# EAGLE board RT5350F_OLinuXino_EVB_Rev_C (EAGLE 4.16), part 1 of 2
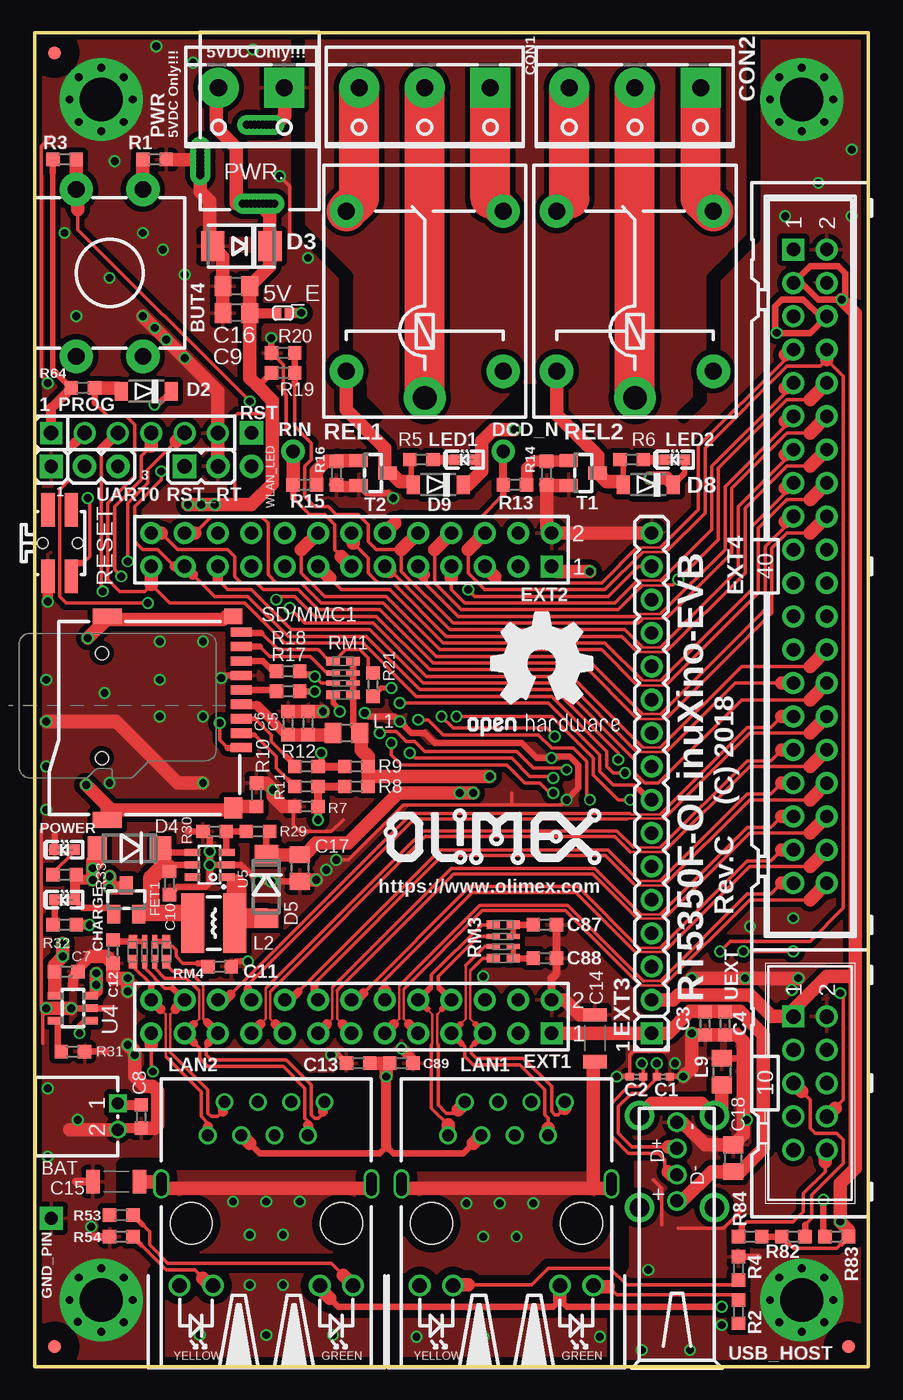
[diagram p1: board, top side]
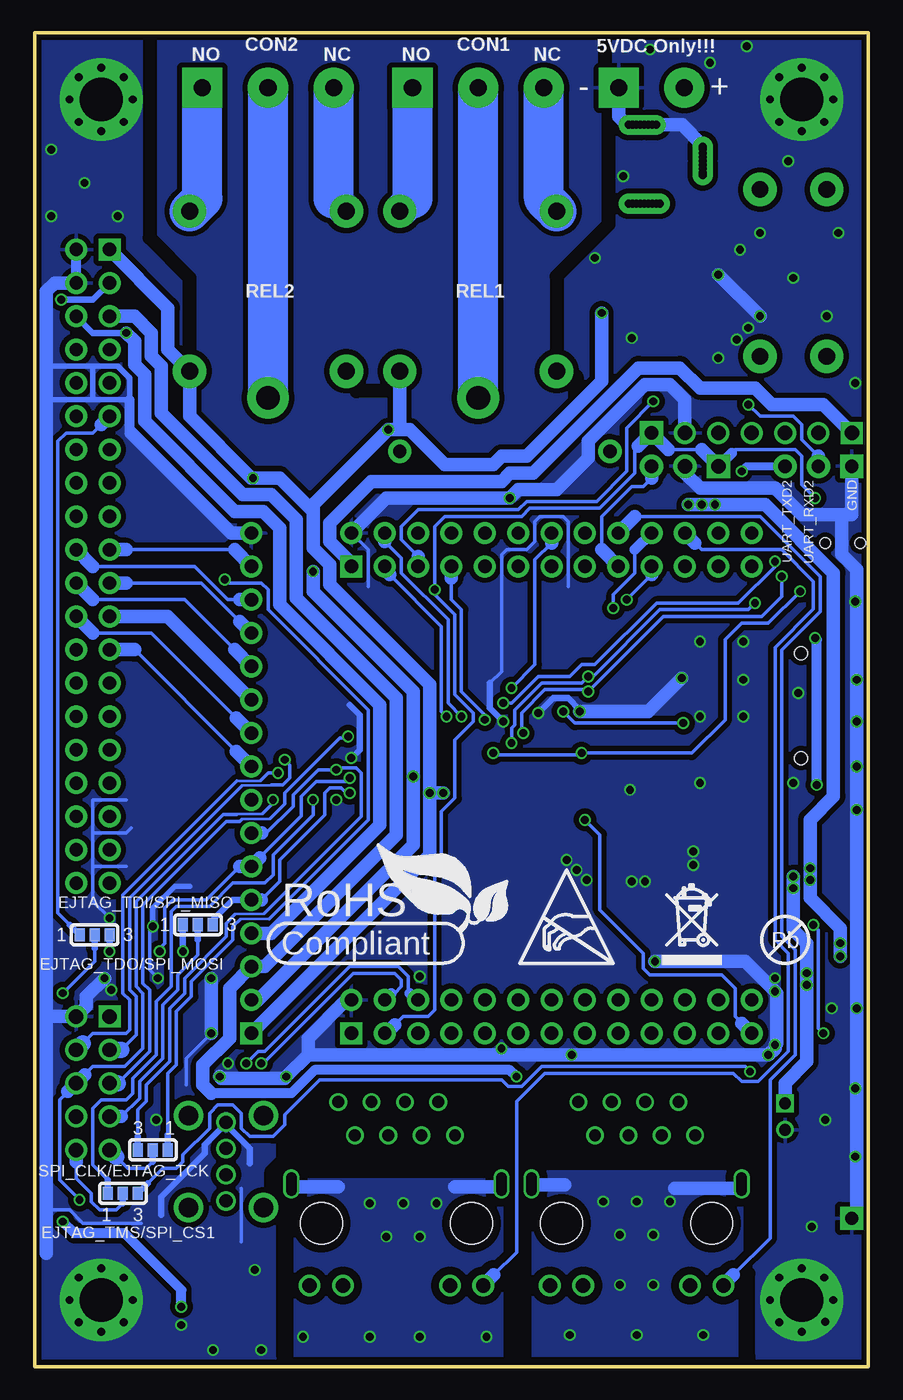
[diagram p2: board, bottom side, seen from below]

Size 63.5 x 101.6 mm. Coordinates in mm from the lower left corner, seen from the top.
Outline: 0,101.6 0,0 63.5,0 63.5,101.6 0,101.6
Copper layers (1+16): Top 0.035mm / dielectric 1.5mm / Bottom 0.035mm
Design rules "default": minimum track width 4mil, minimum drill 0.3mm, track to track 5mil, track to pad 5mil, pad to pad 5mil, via to via 5mil, smd to smd 1mil, copper to edge 10mil, drill to drill 8mil, minimum pad ring 6mil, minimum via ring 4mil, stop-mask expansion 4mil, vias tented up to drill 24mil, thermal gap 15mil
Net classes: 4 REL: width 2.032 mm, drill 2.54 mm
tRestrict: 42 lines
bRestrict: 14 lines

## Footprints (pad centres in the part's own frame; a part is rotated, then mirrored left to right if it is on the bottom)
SJ_1_SMALLER = smd 0.508 x 0.762: 1 -0.381,0; 2 0.381,0
DW02R = drill 0.9 square: 1 -1,0 | drill 0.9 round: 2 1,0
SW_TAKT12X12SS = drill 1.27 pad 2.54 round: P$1 -2.54,-6.35; P$2 2.54,-6.35; P$3 2.54,6.35; P$4 -2.54,6.35
C0402_TI = smd 0.61 x 0.584: 1 -0.508,0; 2 0.508,0
C0603_DWS = smd 1.016 x 1.016: 1 -0.889,0; 2 0.889,0
C0805_5MIL_DWS = smd 1.27 x 1.524: 1 -1.016,0; 2 1.016,0
C1206_5MILS_WS_ISO = smd 1.016 x 1.778: 1 -1.778,0; 2 1.778,0
LED-0603 = smd 0.8 x 0.8: A 0.762,0; C -0.762,0
DG306-5.0_3P = drill 1.3 pad 3.048 square: 1 -5,0 | drill 1.3 pad 3.048 round: 2 0,0; 3 5,0
SOD-123 = smd 1 x 1.4: A 1.9,0; C -1.9,0
DO214AA = smd 1.778 x 2.286: A 2.177,0; C -2.177,0
MLL-41 = smd 1.45 x 1.8: A 2.445,0; K -2.445,0
TESTPAD = drill 1.016 pad 1.778 round: P$1 0,0
SJ_2_SMALL = smd 0.762 x 1.016: 1 -1.143,0; 2 0,0; 3 1.143,0
PN2X13 = drill 1.016 pad 1.676 square: 1 -15.24,1.27 | drill 1.016 pad 1.676 round: 2 -15.24,-1.27; 3 -12.7,1.27; 4 -12.7,-1.27; 5 -10.16,1.27; 6 -10.16,-1.27; 7 -7.62,1.27; 8 -7.62,-1.27; 9 -5.08,1.27; 10 -5.08,-1.27; 11 -2.54,1.27; 12 -2.54,-1.27; 13 0,1.27; 14 0,-1.27; 15 2.54,1.27; 16 2.54,-1.27; 17 5.08,1.27; 18 5.08,-1.27; 19 7.62,1.27; 20 7.62,-1.27; 21 10.16,1.27; 22 10.16,-1.27; 23 12.7,1.27; 24 12.7,-1.27; 25 15.24,1.27; 26 15.24,-1.27
HN1X16 = drill 1.016 pad 1.676 square: 1 -17.78,0 | drill 1.016 pad 1.676 round: 2 -15.24,0; 3 -12.7,0; 4 -10.16,0; 5 -7.62,0; 6 -5.08,0; 7 -2.54,0; 8 0,0; 9 2.54,0; 10 5.08,0; 11 7.62,0; 12 10.16,0; 13 12.7,0; 14 15.24,0; 15 17.78,0; 16 20.32,0
ML40 = drill 1.016 pad 1.676 square: 1 -24.13,-1.27 | drill 1.016 pad 1.676 round: 2 -24.13,1.27; 3 -21.59,-1.27; 4 -21.59,1.27; 5 -19.05,-1.27; 6 -19.05,1.27; 7 -16.51,-1.27; 8 -16.51,1.27; 9 -13.97,-1.27; 10 -13.97,1.27; 11 -11.43,-1.27; 12 -11.43,1.27; 13 -8.89,-1.27; 14 -8.89,1.27; 15 -6.35,-1.27; 16 -6.35,1.27; 17 -3.81,-1.27; 18 -3.81,1.27; 19 -1.27,-1.27; 20 -1.27,1.27; 21 1.27,-1.27; 22 1.27,1.27; 23 3.81,-1.27; 24 3.81,1.27; 25 6.35,-1.27; 26 6.35,1.27; 27 8.89,-1.27; 28 8.89,1.27; 29 11.43,-1.27; 30 11.43,1.27; 31 13.97,-1.27; 32 13.97,1.27; 33 16.51,-1.27; 34 16.51,1.27; 35 19.05,-1.27; 36 19.05,1.27; 37 21.59,-1.27; 38 21.59,1.27; 39 24.13,-1.27; 40 24.13,1.27
SOT23 = smd 1.4 x 1: 1 1.1,-0.95; 2 1.1,0.95; 3 -1.1,0
TEST_PAD40/70/SQUARE = drill 1.016 pad 1.778 square: P$1 0,0
L0805_5MIL_DWS = smd 1.27 x 1.524: 1 -1.016,0; 2 1.016,0
CD42(43) = smd 1.75 x 4.5: 1 -1.6,0; 2 1.6,0
RJLBC-060TC1_MILLING = drill 0.9 round: 1 -4.455,6.7; 2 -3.185,9.24; 3 -1.915,6.7; 4 -0.645,9.24; 5 0.625,6.7; 6 1.895,9.24; 7 3.165,6.7; 8 4.435,9.24 | drill 0.8 round: _1 -8,2.5; _2 -8,2.7; _3 -8,2.9; _4 -8,3.3; _5 -8,3.5; _6 8,3.5; _7 8,3.3; _8 8,2.9; _9 8,2.7; _10 8,2.5; GND1 -8,3.1; GND2 8,3.1 | drill 1.1 round: AG 4.07,-4.748; AY -6.61,-4.748; KG 6.61,-4.748; KY -4.07,-4.748 | hole 3.2: -5.715,0; 5.715,0
PN1X6 = drill 1.1 pad 1.676 square: 1 -6.35,0 | drill 1.1 pad 1.676 round: 2 -3.81,0; 3 -1.27,0; 4 1.27,0; 5 3.81,0; 6 6.35,0
PWR_JACK_UNI_MILLING = drill 0.6 pad 1.5 round: + -0.196,4.75; +1 -0.196,5.05; +2 -0.196,5.35; +3 -0.196,5.65; +4 -0.196,4.45; +5 -0.196,4.15; +6 -0.196,3.85; +7 -0.196,3.55; +8 -0.196,5.95; - -6.196,4.75; -1 -6.196,5.05; -2 -6.196,5.35; -3 -6.196,4.45; -4 -6.196,4.15; -5 -6.196,5.65; -6 -6.196,3.85; -8 -6.196,5.95; -- -3.446,0.3; --1 -3.746,0.3; --2 -4.046,0.3; --3 -4.346,0.3; --4 -3.146,0.3; --5 -2.846,0.3; --6 -2.546,0.3; --14 -4.546,0.3; --15 -2.346,0.3
DG306-5.0_2P = drill 1.3 pad 3.048 square: 1 -2.5,0 | drill 1.3 pad 3.048 round: 2 2.5,0
R0603_5MIL_DWS = smd 1.016 x 1.016: 1 -0.889,0; 2 0.889,0
H200-FAT = drill 1.295 pad 2.54 round: 1 -7.493,-5.969; 2 -7.493,5.969; O 4.699,5.969; S 4.699,-5.969 | drill 1.803 pad 3.175 round: P -9.525,0
SW_TAKT3X4 = smd 2.54 x 1.016: 1_1 2.54,-0.889; 1_2 -2.54,-0.889; 2_1 2.54,0.889; 2_2 -2.54,0.889 | hole 0.8: 0,1.397; 0,-1.27
R_MATRIX_4 = smd 0.635 x 1.016: 1.1 -1.27,-0.762; 1.2 -1.27,0.762; 4.1 1.27,-0.762; 4.2 1.27,0.762 | smd 0.381 x 1.016: 2.1 -0.381,-0.762; 2.2 -0.381,0.762; 3.1 0.381,-0.762; 3.2 0.381,0.762
JP1 = drill 1.1 pad 1.778 square: 1 0,-1.27 | drill 1.1 pad 1.778 round: 2 0,1.27
TFC-WPAPR-08 = smd 1.6 x 0.7: 1 -6.994,2.25; 2 -6.994,1.15; 3 -6.994,0.05; 4 -6.994,-1.05; 5 -6.994,-2.15; 6 -6.994,-3.25; 7 -6.994,-4.35; 8 -6.994,-5.45; 9 -6.994,-6.55 | smd 1.4 x 1.2: 10 -6.369,-7.75 | smd 1.4 x 1.6: 11 -6.369,6.85 | smd 2.2 x 1.2: 12 3.231,-7.75; 13 3.231,7.75 | hole 1: 3.631,-4.95; 3.631,3.05
FIDUCIAL-1X3 = smd 1 x 1: 1 0,0
SOT23-5 = smd 1.2 x 0.55: 1 1.3,-0.95; 2 1.3,0; 3 1.3,0.95; 4 -1.3,0.95; 5 -1.3,-0.95
SOT23-6 = smd 1.2 x 0.55: 1 1.3,-0.95; 2 1.3,0; 3 1.3,0.95; 4 -1.3,0.95; 5 -1.3,0; 6 -1.3,-0.95
HN1X3 = drill 1 pad 1.778 square: 1 -2.54,0 | drill 1 pad 1.778 round: 2 0,0; 3 2.54,0
ML10-MALE = drill 1.1 pad 1.676 square: 1 -5.08,-1.27 | drill 1.1 pad 1.676 round: 2 -5.08,1.27; 3 -2.54,-1.27; 4 -2.54,1.27; 5 0,-1.27; 6 0,1.27; 7 2.54,-1.27; 8 2.54,1.27; 9 5.08,-1.27; 10 5.08,1.27
USB_A_VERTICAL_PTH = drill 1 round: 1 3.45,12.75; 2 3.45,14.75; 3 3.45,16.75; 4 3.45,18.75 | drill 1.5 round: P$1 0.6,12.25; P$2 6.3,12.25; P$3 6.3,19.25; P$4 0.6,19.25

## Placement (x,y rotation side)
5V_E  Opened  [SJ_1_SMALLER]  18.92,80.26 0 top
BAT  DW02R  [DW02R]  6.35,19.05 270 top
BUT4  DTSM24R(12x12x10)  [SW_TAKT12X12SS]  5.71,83.31 180 top
C1  NA  [C0402_TI]  47.88,22.1 0 top
C2  NA  [C0402_TI]  45.85,22.1 180 top
C3  100nF  [C0603_DWS]  51.05,26.16 270 top
C4  22uF/6.3V  [C0603_DWS]  52.58,26.16 270 top
C5  22uF/6.3V  [C0603_DWS]  20.83,49.02 90 top
C6  NA(22uF/6.3V)  [C0603_DWS]  19.3,49.02 90 top
C7  22uF/6.3V  [C0603_DWS]  2.41,30.1 0 top
C8  22uF/6.3V  [C0603_DWS]  8.13,19.05 270 top
C9  47uF/6.3V/20%/X5R/C0805  [C0805_5MIL_DWS]  15.37,80.26 180 top
C10  22uF/6.3V  [C0603_DWS]  10.29,36.83 270 top
C11  100nF  [C0603_DWS]  14.1,30.48 180 top
C12  100nF  [C0603_DWS]  5.97,31.62 90 top
C13  100nF  [C0603_DWS]  24.64,23.11 0 top
C14  1nF/2kV/X7R/1206  [C1206_5MILS_WS_ISO]  42.67,25.02 90 top
C15  1nF/2kV/X7R/1206  [C1206_5MILS_WS_ISO]  6.22,14.1 180 top
C16  47uF/6.3V/20%/X5R/C0805  [C0805_5MIL_DWS]  15.37,82.3 180 top
C17  47uF/6.3V/20%/X5R/C0805  [C0805_5MIL_DWS]  20.19,37.97 270 top
C18  47uF/6.3V/20%/X5R/C0805  [C0805_5MIL_DWS]  53.21,15.88 90 top
C87  100nF  [C0603_DWS]  38.86,33.66 180 top
C88  100nF  [C0603_DWS]  38.86,31.11 180 top
C89  100nF  [C0603_DWS]  27.94,23.11 180 top
CHARGE  LED/YELLOW/0603  [LED-0603]  2.29,35.56 0 top
CON1  CON3-DG306-5.0_3P(TB3-5MM)  [DG306-5.0_3P]  29.72,97.41 180 top
CON2  CON3-DG306-5.0_3P(TB3-5MM)  [DG306-5.0_3P]  45.72,97.41 180 top
D2  1N5819(S4SOD-123)  [SOD-123]  8.51,74.3 180 top
D3  SMBJ6.0A  [DO214AA]  15.75,85.34 180 top
D4  1N5822/SS34/SMA  [MLL-41]  7.24,39.5 180 top
D5  1N5822/SS34/SMA  [MLL-41]  17.65,36.58 270 top
D8  1N5819(S4SOD-123)  [SOD-123]  46.74,67.18 180 top
D9  1N5819(S4SOD-123)  [SOD-123]  30.73,67.18 180 top
DCD_N  TESTPAD40/70  [TESTPAD]  35.69,69.72 0 top
EJTAG_TDI/SPI_MISO  EJTAG_TDI:closed/SPI_MISO:opened  [SJ_2_SMALL]  51.05,33.66 0 bottom
EJTAG_TDO/SPI_MOSI  EJTAG_TDO:closed/SPI_MOSI:opened  [SJ_2_SMALL]  58.93,32.89 0 bottom
EJTAG_TMS/SPI_CS1  EJTAG_TMS:closed/SPI_CS1:opened  [SJ_2_SMALL]  56.77,13.21 0 bottom
EXT1  ML26PN2X13  [PN2X13]  24.13,26.67 180 top
EXT2  ML26PN2X13  [PN2X13]  24.13,62.23 180 top
EXT3  PN1X16  [HN1X16]  46.99,43.18 90 top
EXT4  BH40S  [ML40]  59.05,60.96 270 top
FET1  WPM2015-3/TR  [SOT23]  6.99,35.56 270 top
GND_PIN  TESTPAD3  [TEST_PAD40/70/SQUARE]  1.27,11.3 0 top
L1  FB0805/600R/2A  [L0805_5MIL_DWS]  23.75,48.26 180 top
L2  4.7uH/1.15A/DCR<0.1R/CD43  [CD42(43)]  13.65,33.78 0 top
L9  FB0805/600R/2A  [L0805_5MIL_DWS]  52.32,22.48 270 top
LAN1  RJLBC-060TC1_GND_MILLING  [RJLBC-060TC1_MILLING]  35.94,10.92 0 top
LAN2  RJLBC-060TC1_GND_MILLING  [RJLBC-060TC1_MILLING]  17.65,10.92 0 top
LED1  LED/RED/0603  [LED-0603]  32.77,69.09 0 top
LED2  LED/RED/0603  [LED-0603]  48.77,69.09 0 top
POWER  LED/RED/0603  [LED-0603]  2.29,39.37 0 top
PROG  NA(PN1X6)  [PN1X6]  7.62,71.12 0 top
PWR  PWRJ-2mm(YDJ-1134)  [PWR_JACK_UNI_MILLING]  12.32,88.39 270 top
PWR.  NA(TB2/3.5mm)  [DG306-5.0_2P]  16.51,97.41 180 top
R1  560R  [R0603_5MIL_DWS]  9.14,91.95 180 top
R2  NA  [R0603_5MIL_DWS]  53.59,4.19 270 top
R3  10k  [R0603_5MIL_DWS]  2.29,91.95 180 top
R4  560R  [R0603_5MIL_DWS]  53.59,7.49 90 top
R5  2.2k  [R0603_5MIL_DWS]  29.46,69.09 0 top
R6  2.2k  [R0603_5MIL_DWS]  45.47,69.09 0 top
R7  NA(1M)  [R0603_5MIL_DWS]  20.7,42.67 0 top
R8  10k  [R0603_5MIL_DWS]  24.51,44.2 0 top
R9  10k  [R0603_5MIL_DWS]  24.51,45.72 0 top
R10  10k  [R0603_5MIL_DWS]  16.89,43.56 90 top
R11  100R  [R0603_5MIL_DWS]  20.7,44.2 0 top
R12  100R  [R0603_5MIL_DWS]  20.7,45.72 0 top
R13  1k  [R0603_5MIL_DWS]  36.58,67.18 180 top
R14  10k  [R0603_5MIL_DWS]  38.99,68.07 270 top
R15  1k  [R0603_5MIL_DWS]  20.57,67.18 180 top
R16  10k  [R0603_5MIL_DWS]  22.99,68.07 270 top
R17  100R  [R0603_5MIL_DWS]  19.3,51.44 0 top
R18  100R  [R0603_5MIL_DWS]  19.3,52.96 0 top
R19  1.1k/1%  [R0603_5MIL_DWS]  18.92,75.69 0 top
R20  2.2k  [R0603_5MIL_DWS]  18.92,77.22 180 top
R21  1k  [R0603_5MIL_DWS]  25.78,51.94 90 top
R29  8.25k/1%  [R0603_5MIL_DWS]  17.02,40.77 180 top
R30  1.1k/1%  [R0603_5MIL_DWS]  13.72,40.77 180 top
R31  2k/1%  [R0603_5MIL_DWS]  2.92,24 0 top
R32  2.2k  [R0603_5MIL_DWS]  2.29,33.66 0 top
R33  2.2k  [R0603_5MIL_DWS]  2.29,37.47 180 top
R53  NA  [R0603_5MIL_DWS]  6.6,11.56 180 top
R54  560R  [R0603_5MIL_DWS]  6.6,9.91 180 top
R64  10k  [R0603_5MIL_DWS]  3.68,74.55 180 top
R82  NA(2.2k)  [R0603_5MIL_DWS]  57.78,9.91 180 top
R83  NA(2.2k)  [R0603_5MIL_DWS]  61.09,9.91 0 top
R84  47k  [R0603_5MIL_DWS]  54.48,9.91 0 top
REL1  RAS-0515  [H200-FAT]  29.72,83.31 90 top
REL2  RAS-0515  [H200-FAT]  45.72,83.31 90 top
RESET  SIDE_WTCM-TR(3X4)  [SW_TAKT3X4]  1.91,62.74 270 top
RIN  TESTPAD40/70  [TESTPAD]  19.68,69.72 0 top
RM1  RA1206_(4X0603)_4B8_100K  [R_MATRIX_4]  23.5,52.45 90 top
RM3  NA(RA1206_(4X0603)_4B8_51R)  [R_MATRIX_4]  35.69,32.38 270 top
RM4  NA(RA1206_(4X0603)_4B8_51R)  [R_MATRIX_4]  8.76,31.62 0 top
RST  TESTPAD3  [TEST_PAD40/70/SQUARE]  16.51,71.12 0 top
RST_RT  NA(HN1x2)  [JP1]  12.7,68.58 270 top
SD/MMC1  TFC-WPAPR-08  [TFC-WPAPR-08]  8.76,49.4 180 top
SPI_CLK/EJTAG_TCK  SPI_CLK:opened/EJTAG_TCK:closed  [SJ_2_SMALL]  54.48,16.51 180 bottom
T1  BC817-40(SMD)  [SOT23]  41.78,68.07 180 top
T2  BC817-40(SMD)  [SOT23]  25.78,68.07 180 top
U1  FIDUCIAL  [FIDUCIAL-1X3]  1.52,100.08 0 top
U2  FIDUCIAL  [FIDUCIAL-1X3]  61.98,1.52 0 top
U3  FIDUCIAL  [FIDUCIAL-1X3]  1.52,1.52 0 top
U4  BL4054B-42TPRN  [SOT23-5]  2.92,27.3 0 top
U5  MT3608(SOT23-6)  [SOT23-6]  13.34,38.23 0 top
U$1  [LOGO-OPENHARDWARE_8X8]  38.61,53.47 0 top
U$3  [PB_SMALL]  6.35,32.51 0 bottom
U$8  [RECYCLE_BIN1/8]  15.75,30.61 0 bottom
U$9  [ROHS]  44.7,31.37 0 bottom
U$10  [OLIMEX1_V]  44.32,38.1 0 top
U$11  [ESD_SYMBOL]  26.54,30.73 0 bottom
UART0  HN1X3  [HN1X3]  3.81,68.58 0 top
UEXT  BH10S  [ML10-MALE]  59.05,21.59 270 top
USB_HOST  USB_A_VERTICAL  [USB_A_VERTICAL_PTH]  45.47,-0.13 0 top
WLAN_LED  TESTPAD40/70  [TESTPAD]  16.51,68.58 0 top

## Tracks (layer width: path | path; a pad name or v marks a point on that pad's centre or on a via)
5VDC_IN  (via drill 0.6)
  Top 0.254: 18.1,72.61 15.46,72.61 15.24,72.39 15.24,65.66
  Top 0.406: 17.02,74.68 R19.1
  Top 0.508: 18.29,80.26 5V_E.1 | U4.4 1.52,28.25 1.52,28.57 | CHARGE.A 3.68,34.92 5.57,34.92 FET1.1
  Top 0.762: C9.1 18.29,80.26 | v4.45,37.08 3.05,37.08 | 3.05,37.08 CHARGE.A | R33.1 3.05,37.47 3.05,37.08
  Top 1.016: PWR.+ 18.29,88.59 | PWR..2 13.84,97.24 13.84,94.36 15.37,92.84 15.37,88.59 PWR.+ | PWR.+ 17.91,87.75 17.91,85.36 | 17.91,85.36 D3.C | 17.91,85.36 17.91,83.82 C16.1 C9.1 16.38,75.31 17.02,74.68 18.1,73.6 18.1,72.61 18.1,67.25 16.51,65.66 15.24,65.66 v13.72,65.66 v12.7,65.66 v11.68,65.66 | 1.52,28.57 C7.1 1.52,30.61 v2.16,31.24 v2.16,32.26 | v4.45,37.08 v4.45,37.97 | v4.45,37.97 4.45,38.48 4.57,38.61 4.57,39.27 D4.A 4.79,38.32 v4.45,37.97
  Bottom 1.016: v2.16,31.24 v2.16,32.26 2.16,33.4 4.45,35.69 v4.45,37.08 v4.45,37.97 4.45,41.66 2.67,43.43 2.67,60.45 7.87,65.66 v11.68,65.66 v12.7,65.66 v13.72,65.66
+5V  (via drill 0.6)
  Top 0.406: D8.C 49.53,68.08 LED2.A | 34.04,69.09 LED1.A
  Top 0.508: 19.56,80.26 5V_E.2 | D5.K 17.65,40.51 R29.1
  Top 0.762: v20.32,80.26 19.56,80.26
  Top 1.016: EXT1.1 EXT3.1 48.26,25.4 49.91,27.05 C3.1 C4.1 53.72,27.05 55.5,25.27 55.5,16.64 53.72,14.86 C18.1 51.56,14.86 49.33,12.62 USB_HOST.1 | v33.4,43.69 v32.38,43.69 27.69,43.69 23.88,39.88 21.46,39.88 20.57,38.99 C17.1 17.65,38.99 D5.K | D8.C 48.13,67.69 v46.86,67.69 | v36.58,71.37 34.92,71.37 34.04,70.48 34.04,69.09 34.04,68.2 33.02,67.18 D9.C
  Bottom 1.016: v33.4,43.69 33.4,38.99 EXT3.1 | v33.4,43.69 33.4,51.94 41.02,59.56 41.02,61.09 42.29,62.36 42.29,65.15 | EXT4.1 53.34,80.64 53.34,77.47 REL2.1 51.69,72.39 46.99,67.69 v46.86,67.69 44.83,67.69 42.29,65.15 | 42.29,65.15 42.29,65.66 v36.58,71.37 35.69,71.37 | 35.69,71.37 REL1.1 | 35.69,71.37 34.92,71.37 32.26,68.71 28.57,68.71 27.94,69.34 26.04,69.34 20.32,75.06 v20.32,80.26 | v32.38,43.69 v33.4,43.69
COMP
  Bottom 0.254: 47.88,56.77 50.8,59.69 56.52,59.69
  Bottom 1.016: EXT3.13 47.88,56.77 | 56.52,59.69 EXT4.21
CTS_N
  Top 0.178: 46.3,54.79 47.68,54.79
  Top 0.203: 46.28,54.81 46.3,54.79 | 47.68,54.79 47.7,54.81
  Top 0.254: 27.05,60.58 27.3,60.33 27.43,60.33 31.62,56.13 44.96,56.13 46.28,54.81 | 47.7,54.81 53.59,60.71 53.59,65.53 57.15,69.09 57.15,69.47
  Top 1.016: 27.05,60.58 EXT2.11 | 57.15,69.47 57.53,69.85 EXT4.13
DAT1
  Top 0.254: RM1.3.2 22.25,52.83 20.98,54.1 17.91,54.1 17.14,54.86
  Top 0.508: SD/MMC1.8 15.77,54.86 17.14,54.86
DAT2  (via drill 0.6)
  Top 0.254: 14.73,47.12 14.1,47.75 v14.1,49.02
  Top 0.406: RM1.1.2 22.73,50.55 23.24,50.04 v23.24,49.91
  Top 0.508: SD/MMC1.1 15.72,47.12 14.73,47.12
  Bottom 0.254: v23.24,49.91 22.35,49.02 v14.1,49.02
DCD_N
  Top 0.254: 27.43,64.26 27.94,64.77 34.04,64.77 35.69,66.42
  Top 0.508: 35.69,66.42 R13.2
  Top 0.61: R13.2 DCD_N.P$1
  Top 1.016: EXT2.12 27.43,64.26
DTR_N
  Top 0.178: 45.9,51.89 48.08,51.89
  Top 0.203: 45.87,51.92 45.9,51.89 | 48.08,51.89 48.11,51.92
  Top 0.254: 20.32,62.23 20.32,60.45 22.1,58.67 26.8,58.67 30.86,54.61 43.18,54.61 45.87,51.92 | 59.05,66.04 57.28,66.04 55.12,63.88 55.12,58.93 48.11,51.92
  Top 1.016: 20.32,62.23 EXT2.16 | 59.05,66.04 EXT4.16
EJTAG_TCK  (via drill 0.6)
  Top 0.178: 48.08,59.51 46.3,59.51
  Top 0.203: 46.3,59.51 46.28,59.49 | 48.11,59.54 48.08,59.51
  Top 0.254: 30.48,62.23 30.48,59.69 32.51,57.66 44.45,57.66 46.28,59.49 | 59.05,73.66 57.28,73.66 52.07,68.45 52.07,62.99 v49.02,59.94 48.62,59.54 48.11,59.54
  Top 1.016: 30.48,62.23 EXT2.8 | 59.05,73.66 EXT4.10
  Bottom 0.178: 47.84,34.07 47.8,34.11 45.64,34.11
  Bottom 0.254: v49.02,59.94 48.77,59.69 46.23,59.69 45.72,59.18 45.72,57.66 38.1,50.04 38.1,41.66 45.64,34.11 | 47.84,34.07 48.39,33.53 48.39,32.51 51.56,29.34 51.56,28.19 52.7,27.05 52.7,22.99 53.34,22.35 53.34,17.65
  Bottom 0.508: SPI_CLK/EJTAG_TCK.1 53.34,17.65
EJTAG_TCK/SPI_CLK
  Bottom 0.254: 54.48,15.62 54.99,15.11 56.39,15.11 57.28,16
  Bottom 0.508: 54.48,15.62 SPI_CLK/EJTAG_TCK.2
  Bottom 1.27: 57.28,16 UEXT.9
EJTAG_TDI  (via drill 0.6)
  Top 0.178: 48.08,62.05 46.3,62.05
  Top 0.203: 46.3,62.05 46.28,62.03 | 48.11,62.08 48.08,62.05
  Top 0.254: 33.02,62.23 33.02,60.45 34.29,59.18 43.43,59.18 46.28,62.03 | 48.11,62.08 51.05,65.02 51.05,69.98 57.28,76.2 59.82,76.2 60.33,76.71 61.59,75.44 61.59,34.92 59.05,32.38 52.96,32.38 v52.2,31.62
  Top 1.016: 33.02,62.23 EXT2.6 | 60.33,76.71 EXT4.8
  Bottom 0.508: v52.2,31.62 EJTAG_TDI/SPI_MISO.1
EJTAG_TDI/SPI_MISO
  Bottom 0.254: 51.05,32.51 51.05,31.37 52.58,29.84 52.58,28.7 53.72,27.56 53.72,23.5 55.5,21.72 55.5,20.45 56.9,19.05
  Bottom 0.508: 51.05,32.51 EJTAG_TDI/SPI_MISO.2
  Bottom 1.016: UEXT.7 56.9,19.05
EJTAG_TDO
  Top 0.178: 45.9,57.33 47.68,57.33
  Top 0.203: 45.87,57.3 45.9,57.33 | 47.68,57.33 47.7,57.35
  Top 0.254: 29.59,60.33 29.84,60.07 29.84,59.56 32.26,57.15 45.72,57.15 45.87,57.3 | 47.7,57.35 52.58,62.23 52.58,67.06 57.15,71.63 57.15,72.01
  Top 1.016: 29.59,60.33 29.21,60.71 EXT2.9 | 57.15,72.01 57.53,72.39 EXT4.11
  Bottom 0.254: 58.42,71.75 59.05,71.12 61.09,71.12 61.72,70.48 61.72,34.54 60.83,33.66
  Bottom 0.508: 60.83,33.66 EJTAG_TDO/SPI_MOSI.1
  Bottom 1.016: EXT4.11 58.42,71.75
EJTAG_TDO/SPI_MOSI  (via drill 0.6)
  Top 0.254: 60.96,19.68 61.59,20.32 61.59,28.19 v61.34,28.45
  Top 1.016: UEXT.8 60.96,19.68
  Bottom 0.254: 58.93,31.88 58.93,30.86 v61.34,28.45
  Bottom 0.508: 58.93,31.88 EJTAG_TDO/SPI_MOSI.2
EJTAG_TMS  (via drill 0.6)
  Top 0.178: 45.9,59.87 47.68,59.87
  Top 0.203: 45.87,59.84 45.9,59.87 | 47.68,59.87 47.7,59.89
  Top 0.254: 31.75,60.07 31.75,59.18 32.77,58.17 44.2,58.17 45.87,59.84 | 57.15,74.55 57.15,74.17 51.56,68.58 51.56,63.75 47.7,59.89 | v29.21,49.28 29.97,49.28 31.11,48.13 38.35,48.13 39.37,47.12 41.02,47.12 42.04,46.1 42.04,43.43 v42.29,43.18
  Top 1.016: EXT2.7 31.75,60.07 | 57.15,74.55 57.53,74.93 EXT4.9
  Bottom 0.254: 31.75,60.07 31.75,58.42 30.99,57.66 30.99,51.44 29.21,49.66 v29.21,49.28 | v42.29,43.18 42.29,42.04 45.34,38.99 45.34,37.47 45.97,36.83 48.39,36.83 50.16,35.05 52.7,35.05 53.09,34.67 53.09,28.96 54.23,27.81 54.23,23.75 56.01,21.97 56.01,20.83 56.52,20.32 58.42,20.32 59.05,19.68 59.05,15.37 57.91,14.22
  Bottom 0.508: EJTAG_TMS/SPI_CS1.1 57.91,14.22
  Bottom 1.016: 31.75,60.07 EXT2.7
EJTAG_TMS/SPI_CS1
  Top 0.254: 53.85,10.67 54.23,11.05 57.78,11.05 58.55,11.81 58.55,13.21 60.2,14.86 60.2,15.62
  Top 0.508: R84.1 53.85,10.16 53.85,10.67
  Top 1.016: 60.2,15.62 60.2,16.38 UEXT.10
  Bottom 0.254: 56.77,12.45 57.28,11.94 58.55,11.94 59.18,12.57 59.18,13.21 60.33,14.35 60.33,15.62
  Bottom 0.508: 56.77,12.45 EJTAG_TMS/SPI_CS1.2
  Bottom 1.016: UEXT.10 60.33,15.62
EJTAG_TRSTN
  Top 0.178: 46.3,56.97 48.08,56.97
  Top 0.203: 46.28,56.95 46.3,56.97 | 48.08,56.97 48.11,57
  Top 0.254: 46.28,56.95 45.97,56.64 31.88,56.64 27.94,60.58 27.94,62.23 26.04,62.23 25.4,62.87 25.4,64.14 24.64,64.9 22.99,64.9 22.35,65.53 21.34,65.53 20.57,66.29 20.57,68.58 21.08,69.09 21.08,70.36 19.81,71.63 19.81,74.8 | 59.05,71.12 57.28,71.12 53.09,66.93 53.09,61.98 48.11,57
  Top 0.508: R20.1 R19.2 19.81,74.8
  Top 1.016: 27.94,62.23 EXT2.10 | 59.05,71.12 EXT4.12
EXT_LDO_1P2
  Bottom 1.016: EXT3.11 53.34,57.15 EXT4.23
FB
  Bottom 0.254: 48.13,49.4 54.61,55.88 59.05,55.88
  Bottom 1.016: 59.05,55.88 EXT4.24 | EXT3.10 48.13,49.4
GND  (via drill 0.6, 3.3 pad 6.3)
  Top 0.254: 1.27,93.73 0.51,92.96 0.51,75.44 v1.02,74.93 | v22.99,38.61 23.88,38.61 28.07,42.8 36.32,42.8 | 36.32,42.8 40.13,42.8 v40.51,43.18 | 19.68,42.67 19.68,41.27 20.19,40.77 22.61,40.77 23.5,41.66 | C2.2 45.34,23.75 45.59,24 48.26,24 | 49.02,10.54 52.45,10.54 53.72,11.81 53.72,12.06 | 47.75,10.79 47.75,13.59 47.12,14.22 | 0.64,27.3 0.64,24.64 | v0.89,27.3 0.64,27.3 | 0.76,41.15 0.51,40.89 0.51,27.43 0.64,27.3 | 19.43,85.47 19.43,89.92 v18.67,90.68 | 36.32,42.8 36.32,43.69 | R20.2 18.92,76.33 18.92,74.3 19.18,74.04 19.18,71.37
  Top 0.406: v44.32,22.1 C2.2 | v49.4,22.1 C1.2
  Top 0.508: T2.2 25.25,66.55 26.92,66.55 v27.3,66.17 | v14.22,52.45 14.43,52.65 SD/MMC1.6 | C11.1 15.37,30.86 v16.26,30.86 | R20.2 v18.03,78.36 | v22.61,23.75 23.11,23.75 C13.1 | R4.2 55.12,8.38 | 53.98,23.5 L9.1 | v2.79,27.3 U4.2 5.84,27.3 | R31.2 5.46,24 | v13.34,38.23 U5.2 15.75,38.23 v17.02,36.96 C17.2 | v13.34,38.23 13.34,36.83 13.03,36.52 10.87,36.52 C10.2 | v13.34,38.23 v13.34,39.24 13.34,40.26 R30.2 11.68,40.77 | POWER.C 1.52,40.51 | v25.15,49.78 25.4,49.53 27.43,49.53 v27.81,49.15 28.7,48.26 29.72,48.26 30.48,47.5 37.08,47.5 38.23,46.35 v39.37,46.35 39.5,46.48 40.77,46.48 41.4,45.85 41.4,44.07 v40.51,43.18
  Top 0.61: C87.1 C88.1 39.75,29.97 39.37,29.59 EXT1.2 | 4.57,9.91 R54.2 | C15.2 3.17,14.1
  Top 0.762: C89.1 28.83,23.37 v27.94,24.26 | BAT.2 6.46,18.16 C8.2 | 4.32,31.24 3.3,30.23 C7.2 2.92,29.72 2.92,28.96
  Top 0.813: v1.02,58.29 RESET.1_1
  Top 0.889: R16.2 23.11,67.06 24.61,67.06 T2.2
  Top 1.016: USB_HOST.4 49.32,18.62 51.05,16.89 C18.2 53.98,17.65 53.98,23.5 53.98,24.77 53.47,25.27 C4.2 C3.2 50.04,25.27 | EXT3.16 EXT2.2 38.99,63.88 R14.2 39.05,67.12 T1.2 | RST_RT.2 PROG.6 13.97,74.3 v11.43,76.83 v8.26,80.01 | R1.1 12.62,91.95 PWR.-- 12.62,89.49 13.34,88.77 13.34,85.58 D3.A 14.35,84.56 C16.2 C9.2 | C6.2 C5.2 v21.97,49.91 | R10.2 17.65,44.45 v18.16,43.94 18.16,43.43 18.92,42.67 19.68,42.67 R7.1 | PWR.- 18.39,94.59 19.05,95.25 19.05,97.41 PWR..1 | v0.89,49.15 6.22,49.15 10.92,44.45 v12.83,44.45 | v58.17,29.59 v50.04,29.59 | v49.4,22.1 50.04,22.73 50.04,25.27 | v50.04,25.4 50.04,25.27 | EXT1.2 40.39,27.94 41.53,26.8 C14.2 | C8.2 9.14,18.16 9.4,18.41 9.4,20.95 9.02,21.34 8.38,21.34 7.62,22.1 v7.62,23.75 7.62,24 v7.11,24.51 | BAT.2 6.33,18.03 2.67,18.03 | v0.89,27.3 v2.79,27.3 | C17.2 20.19,37.08 v21.46,37.08 | v7.11,28.57 v7.11,29.59 5.97,29.59 C12.1 5.46,31.24 4.32,31.24
  Bottom 0.254: EXT2.2 38.1,62.23 38.1,59.44 | 62.61,11.94 60.83,11.94 59.82,10.92 55.37,10.92 | 28.83,52.07 27.94,52.96 27.94,61.85 27.56,62.23 26.04,62.23 25.4,62.87 25.4,64.39 25.02,64.77 23.24,64.77 22.86,64.39 22.86,59.44 | v50.04,25.4 51.94,23.5 51.94,21.46 | v54.1,29.59 54.74,30.23 54.74,33.27 v54.48,33.53 | v57.78,34.16 59.05,35.43 59.05,38.1 | 59.05,38.1 59.05,40.64 | 59.05,40.64 56.52,40.64 56.13,41.02 | 59.05,40.64 59.05,43.18 56.52,43.18 | 47.75,9.53 47.75,13.59 | 59.05,38.1 56.52,38.1
  Bottom 0.406: 59.05,73.66 62.61,73.66 | 59.05,76.2 62.61,76.2 | 59.05,76.2 57.15,76.2 56.26,75.31 56.26,73.66 59.05,73.66 | 59.05,73.66 59.05,76.2 | v54.48,33.53 54.48,34.92 52.83,36.58 51.69,36.58
  Bottom 0.508: v21.97,49.91 21.97,50.04 22.86,50.93 24,50.93 v25.15,49.78 | v27.81,49.15 28.83,50.16 28.83,52.07 | v39.37,46.35 38.73,46.99 38.73,49.66 39.5,50.42 | USB_HOST.4 48.92,18.52 | 48.92,18.52 50.55,16.89 50.55,16.26 53.85,12.95 53.85,11.56 | 48.92,18.52 48.92,18.44 47.12,16.64 47.12,15.49
  Bottom 0.762: EXT4.4 EXT4.2 | 56.13,71.12 56.26,71.25 56.26,73.66 | 27.94,23.75 v27.94,24.26
  Bottom 1.016: 12.7,91.36 12.7,93.09 14.2,94.59 PWR.- 18.39,94.59 19.01,95.21 PWR..1 | 2.03,64.9 2.03,61.85 0.89,60.71 v0.89,52.32 v0.89,49.15 v0.89,45.72 v0.89,27.3 0.89,11.68 GND_PIN.P$1 | UART0.1 1.27,64.9 2.03,64.9 | EXT2.2 36.7,66.17 v27.3,66.17 26.67,66.8 23.75,66.8 21.34,69.22 21.34,70.48 17.02,74.8 15.11,74.8 13.97,73.66 PROG.6 | v58.17,29.59 59.56,28.19 59.56,27.43 UEXT.2 62.61,26.67 | EXT4.4 61.98,82.55 62.61,81.92 62.61,76.2 62.61,73.66 62.61,26.67 | EXT3.16 48.51,63.5 56.13,71.12 | RST_RT.2 13.97,68.07 12.83,66.93 7.11,66.93 5.08,64.9 2.03,64.9 | v8.26,80.01 v11.43,83.19 | v16.26,30.86 9.4,30.86 v7.11,28.57 6.99,28.45 6.99,24.64 v7.11,24.51 7.11,24.26 v7.62,23.75 v22.61,23.75 27.94,23.75 42.67,23.75 | 42.67,23.75 v44.32,22.1 44.45,21.97 49.28,21.97 v49.4,22.1 | EXT1.2 39.75,27.94 42.67,25.02 42.67,23.75 | v50.04,29.59 v50.04,25.4 | 62.61,26.67 62.61,11.94 62.61,8.64 | v14.22,52.45 16.76,49.91 v21.97,49.91
  other vias: 5.08,5.08 3.37,6.79 5.08,7.49 6.79,6.79 7.49,5.08 6.79,3.37 5.08,2.67 2.67,5.08 58.42,5.08 56.01,5.08 56.71,6.79 58.42,7.49 60.13,6.79 60.83,5.08 60.13,3.37 58.42,2.67 56.71,3.37 58.42,96.52 56.01,96.52 56.71,98.23 58.42,98.93 60.13,98.23 60.83,96.52 60.13,94.81 58.42,94.11 56.71,94.81 5.08,96.52 2.67,96.52 3.37,98.23 5.08,98.93 6.79,98.23 7.49,96.52 6.79,94.81 5.08,94.11 3.37,94.81 46.23,1.27 52.32,3.17 57.66,28.7 62.23,92.71 9.27,100.58 6.1,91.82 5.71,82.93 3.17,80.01 8.26,86.36 2.29,86.36 16.64,100.33 12.06,99.31 59.69,90.17 57.15,87.63 62.23,87.63 12.83,49.53 9.53,49.53 9.53,52.32 12.83,55.24 9.53,55.24 49.91,1.27 20.83,84.45 5.71,44.45 9.14,79.12 10.03,78.23 48.77,23.11 0.89,42.42 18.03,36.96 22.23,37.85 5.33,51.31 46.74,7.37 9.78,85.09 34.16,29.72 1.02,21.21 1.02,16 3.3,18.8 4.32,10.67 54.23,18.8 3.3,3.43
  pour Top (isolate 0.406, rank 3): -7.62,104.27 68.58,104.14 68.58,-2.54 -7.62,-2.41
  pour Bottom (isolate 0.406, rank 3): -10.16,-5.08 -10.16,106.68 71.12,106.68 71.12,-5.08
GPIO0  (via drill 0.6)
  Top 0.178: 45.9,62.41 47.68,62.41
  Top 0.203: 45.87,62.38 45.9,62.41 | 47.68,62.41 47.7,62.43
  Top 0.254: 35.05,60.2 35.56,59.69 43.18,59.69 45.87,62.38 | 57.15,77.09 57.15,76.71 50.55,70.1 50.55,65.28 47.7,62.43 | v16.38,73.53 3.3,86.61 3.3,88.14
  Top 1.016: EXT2.5 35.05,60.2 | 57.15,77.09 57.53,77.47 EXT4.7 | R3.1 BUT4.P$2 3.3,89.53 3.3,88.14
  Bottom 0.254: 34.29,61.72 35.56,62.99 35.56,64.01 34.29,65.28 26.67,65.28 26.04,65.91 20.7,65.91 18.41,68.2 18.41,71.5 v16.38,73.53
  Bottom 1.016: 34.29,61.72 EXT2.5
I2C_SCL  (via drill 0.6)
  Top 0.254: v30.99,49.53 31.88,48.64 38.99,48.64 v39.62,48.01 | 58.42,20.95 59.05,20.32 59.05,18.16 59.44,17.78 61.09,17.78 61.59,17.27 61.59,15.49 59.18,13.08 59.18,11.3 58.67,10.79
  Top 0.508: R82.1 58.67,10.79
  Top 1.016: 58.42,20.95 UEXT.5
  Bottom 0.178: 47.71,41.69 47.68,41.73 45.57,41.73
  Bottom 0.203: 45.57,41.73 45.54,41.76
  Bottom 0.254: 57.15,21.59 54.74,24 54.74,28.7 55.24,29.21 55.24,35.18 48.9,41.53 47.88,41.53 47.71,41.69 | 45.54,41.76 44.45,42.85 44.45,43.69 40.26,47.88 39.75,47.88 v39.62,48.01 | 36.83,62.87 35.56,61.59 35.56,60.45 32,56.9 32,50.55 v30.99,49.53
  Bottom 1.016: 36.83,62.87 EXT2.4
  Bottom 1.27: UEXT.5 57.15,21.59
I2C_SDA  (via drill 0.6)
  Top 0.254: v45.34,43.18 44.45,43.18 42.55,45.09 42.55,46.35 39.37,49.53 v32.13,49.53
  Top 0.508: v60.07,12.7 60.07,10.03 R83.1
  Bottom 0.178: 48.08,42.09 46.18,42.09 46.14,42.13
  Bottom 0.203: 48.11,42.06 48.08,42.09
  Bottom 0.254: 59.69,22.23 59.05,22.86 56.64,22.86 55.24,24.26 55.24,28.45 55.75,28.96 55.75,35.43 49.12,42.06 48.11,42.06 | 46.14,42.13 45.34,42.93 v45.34,43.18 | v32.13,49.53 32.51,49.91 32.51,56.39 36.45,60.33 | v60.07,12.7 61.59,14.22 61.59,20.32 60.96,20.95
  Bottom 1.016: 59.69,22.23 UEXT.6 60.96,20.95 | 36.45,60.33 36.83,60.71 EXT2.3
LDOSEL
  Bottom 0.254: 48.26,54.61 52.07,58.42 59.05,58.42
  Bottom 1.016: 59.05,58.42 EXT4.22 | EXT3.12 48.26,54.61
LGATE
  Bottom 0.254: 48.13,46.86 55.88,54.61
  Bottom 1.016: EXT3.9 48.13,46.86 | 55.88,54.61 EXT4.25
LINK0
  Bottom 0.254: 17.78,64.77 8.26,64.77 3.68,60.2 3.68,57.51 6.6,54.59 6.6,32.77 5.59,31.75 5.59,23.75 7.49,21.84 7.49,9.78 10.29,6.99
  Bottom 1.016: 17.78,64.77 EXT2.18 | LAN2.AY 11.04,6.23 10.29,6.99
LINK1  (via drill 0.6)
  Top 0.178: 46.3,47.17 46.3,47.16 47.66,47.16 47.68,47.17
  Top 0.203: 46.28,47.19 46.3,47.17 | 47.68,47.17 47.7,47.19
  Top 0.254: v18.41,58.42 18.67,58.67 19.81,58.67 21.34,57.15 26.04,57.15 30.1,53.09 40.39,53.09 46.28,47.19 | 59.05,53.34 53.85,53.34 47.7,47.19
  Top 1.016: 59.05,53.34 EXT4.26
  Bottom 0.254: 16.51,60.33 v18.41,58.42
  Bottom 1.016: 16.51,60.33 EXT2.19
LINK2  (via drill 0.6)
  Top 0.178: 45.88,46.83 48.09,46.83 48.11,46.84
  Top 0.203: 45.87,46.84 45.88,46.83
  Top 0.254: v19.43,57.78 20.57,56.64 25.78,56.64 29.84,52.58 40.13,52.58 45.87,46.84 | 48.11,46.84 53.34,52.07 56.9,52.07
  Top 1.016: 56.9,52.07 EXT4.27
  Bottom 0.254: v19.43,57.78 19.43,58.8 17.78,60.45 17.78,62.23
  Bottom 0.813: 17.78,62.23 EXT2.20
LINK3
  Top 0.254: 13.97,59.94 14.73,59.18 16.51,59.18 19.56,56.13 25.53,56.13 29.59,52.07 39.88,52.07 45.72,46.23 45.72,45.21 46.48,44.45 47.5,44.45 53.85,50.8 59.05,50.8
  Top 0.813: 13.97,59.94 EXT2.21
  Top 1.016: 59.05,50.8 EXT4.28
LINK4
  Bottom 0.254: 13.21,62.74 12.7,62.23 6.6,62.23 4.19,59.82 4.19,57.71 7.11,54.79 7.11,32.51 6.1,31.5 6.1,24 8.38,21.72 9.65,21.72 10.29,22.35 24.64,22.35 26.8,20.19 26.8,8.71 28.52,6.99
  Bottom 1.016: 13.21,62.74 EXT2.22 | 28.52,6.99 LAN1.AY
MMC1_CD/DSR_N  (via drill 0.6)
  Top 0.178: 45.9,54.43 48.08,54.43
  Top 0.203: 45.87,54.46 45.9,54.43 | 48.08,54.43 48.11,54.46
  Top 0.254: 24.26,62.74 25.4,61.59 25.4,60.45 26.16,59.69 27.3,59.69 31.37,55.63 44.7,55.63 45.87,54.46 | 59.05,68.58 57.28,68.58 54.1,65.41 54.1,60.45 48.11,54.46
  Top 0.406: R21.1 26.42,51.69 v27.18,51.69
  Top 1.016: 24.26,62.74 24.26,63.5 EXT2.14 | 59.05,68.58 EXT4.14
  Bottom 0.254: 24.13,62.74 25.4,61.47 25.4,53.47 v27.18,51.69
  Bottom 1.016: 24.13,62.74 EXT2.14
N$1
  Top 1.016: BUT4.P$1 R1.2
N$2
  Top 0.762: R5.2 LED1.C
N$3
  Top 1.016: USB_HOST.P$4 47.01,20.07 50.82,20.07 USB_HOST.P$3 52.32,19.68 L9.2
N$4
  Top 0.406: 44.84,67.44 44.84,68.83 R6.1
  Top 1.016: REL2.2 39.75,72.52 42.88,69.39 T1.3 43.52,67.44 44.84,67.44 D8.A
N$5
  Top 0.762: R6.2 LED2.C
N$6  (via drill 0.6)
  Top 0.508: v9.14,73.27 9.39,73.27 D2.C
  Bottom 0.254: v9.14,73.27 8.26,72.39 5.71,72.39 5.08,71.75 5.08,70.61 3.81,69.34
  Bottom 1.016: UART0.2 3.81,69.34
N$7
  Top 0.254: 17.27,55.88 18.54,54.61 21.59,54.61 22.48,53.72 RM1.4.2 22.81,53.72 23.7,54.61 24.77,54.61 25.4,53.98 25.4,53.21 R21.2
  Top 0.508: SD/MMC1.9 15.83,55.88 17.27,55.88
N$8
  Top 0.254: 16.76,48.13 18.41,46.48 18.41,45.59 19.3,44.7
  Top 0.381: R11.1 19.3,44.7 | 16.76,48.13 15.88,48.13 SD/MMC1.2
N$9
  Top 0.254: 16.81,49.35 18.03,48.13 18.03,47.62 19.18,46.48
  Top 0.381: 16.81,49.35 SD/MMC1.3
  Top 0.508: R12.1 19.81,45.85 19.18,46.48
N$10
  Top 0.508: SD/MMC1.5 18.3,51.55 R17.1
N$11
  Top 0.889: R13.1 37.47,68.45 37.97,68.96 R14.1 40.68,68.96 T1.1
N$12
  Top 1.016: R15.1 21.46,68.2 22.23,68.96 R16.1 23.05,69.02 T2.1
N$13
  Top 0.508: SD/MMC1.7 17.37,53.75 18.16,52.96 R18.1
N$14  (via drill 0.6)
  Top 1.016: SD/MMC1.10 14.61,57.15 14.35,56.9 5.53,56.9 SD/MMC1.12 5.53,56.97 v4.06,55.5 | 5.53,42.42 5.53,42.73 v3.94,44.32 | SD/MMC1.13 5.53,42.42 | 5.53,42.42 15,42.42 SD/MMC1.11 15.25,42.67 R10.1
  Bottom 0.762: v3.94,44.32 3.94,55.37 v4.06,55.5
N$15
  Top 0.508: C10.1 10.29,37.97 10.54,38.23 U5.5 | 9.68,38.99 9.65,38.99 9.84,39.18 U5.4
  Top 1.016: 9.68,38.99 D4.K | 9.68,38.1 10.29,38.1 C10.1 9.4,37.72 | FET1.2 8.02,34.54 8.27,34.54
  Top 1.27: 9.68,38.1 9.68,38.99 | 9.4,37.72 8.89,37.21 8.89,34.54 | 8.27,34.54 8.89,34.54 | 8.89,34.54 12.05,34.54 L2.1
N$16  (via drill 0.6)
  Top 1.016: C15.1 9.58,14.1 LAN2.GND1 9.65,13.59 25.65,13.59 25.65,13.8 LAN2.GND2
  Bottom 1.016: LAN2.GND1 9.65,13.59 14.73,13.59 | LAN2.GND2 25.65,13.84 23.11,13.84
  other vias: 15.11,12.57 17.65,12.57 20.19,12.57 18.92,10.03 16.38,10.03 16.38,6.22 18.92,6.22 22.73,2.41 17.65,2.41 12.57,2.41
  pour Top (isolate 0.61): 9.78,-0.13 9.78,14.86 25.65,14.86 25.65,-0.13
  pour Bottom (isolate 0.61): 25.53,14.86 25.53,-0.13 9.65,-0.13 9.65,14.86
N$17
  Top 0.254: RM4.4.2 10.03,32 10.54,32 10.79,31.75 10.79,31.24 11.3,30.73 12.45,30.73
  Top 0.406: RM4.3.2 RM4.4.2
  Top 0.508: 12.45,30.73 13.21,30.73 C11.2
N$18
  Top 0.406: RM4.1.2 RM4.2.2
  Top 0.508: C12.2 5.97,32.38 RM4.1.2
N$19
  Top 0.61: 17.02,50.29 16.89,50.42 15.79,50.42 SD/MMC1.4
  Top 0.762: C6.1 19.18,48.13 17.02,50.29
  Top 1.016: C6.1 C5.1 22.61,48.13 L1.2
N$20
  Top 0.254: 23.5,6.98 22.61,7.87 10.16,7.87 8.76,9.27 8.76,10.29 8.26,10.79
  Top 0.381: R53.1 8.26,10.79
  Top 1.016: 23.5,6.98 24.26,6.22 LAN2.KG
N$21
  Top 0.254: 12.83,6.73 12.19,7.37 10.03,7.37 8.13,9.27
  Top 0.381: R54.1 8.13,9.27
  Top 1.016: 12.83,6.73 13.21,6.35 13.41,6.35 LAN2.KY
N$23  (via drill 0.6)
  Top 1.016: 42.55,13.59 42.55,23.11 C14.1 | LAN1.GND1 27.94,13.59 42.55,13.59 | 42.55,13.59 43.94,13.59 LAN1.GND2
  Bottom 1.016: LAN1.GND1 27.94,13.72 31.5,13.72 | 40.39,13.72 43.94,13.72
  other vias: 32.89,12.45 35.43,12.45 37.97,12.45 36.7,9.91 34.16,9.91 34.16,2.29 29.08,2.29 37.97,2.29 43.05,2.29
  pour Bottom (isolate 0.61): 27.94,14.22 43.94,14.22 43.94,0 27.94,0
  pour Top (isolate 0.61): 28.19,14.73 43.94,14.73 43.94,0 28.19,0
N$27
  Top 3.048: REL2.P CON2.2
  Bottom 3.048: REL2.P CON2.2
N$29  (via drill 0.6)
  Top 0.508: U4.1 3.81,26.36 3.43,25.97 v3.43,25.4
  Top 0.762: v4.19,33.66 R32.2
  Bottom 0.254: v3.43,25.4 3.81,25.78 3.81,33.27 v4.19,33.66
N$32
  Top 0.406: R5.1 28.7,68.96 28.7,67.56 28.58,67.44
  Top 1.016: REL1.2 23.75,72.9 26.67,69.98 26.67,68.28 T2.3 27.18,68.07 27.81,67.44 28.58,67.44 D9.A
N$33
  Top 0.406: RM3.4.2 RM3.3.2
  Top 0.508: C88.2 RM3.4.2
N$34
  Top 3.048: REL1.P CON1.2
  Bottom 3.048: REL1.P CON1.2
N$35
  Top 0.508: U5.1 15.37,37.28 15.37,36.7
  Top 1.27: 17.62,34.16 D5.A
  Top 1.524: 15.37,34.16 15.37,33.78 L2.2 | 15.37,36.7 15.37,34.16 | 15.37,34.16 17.62,34.16
N$36
  Top 0.508: U5.3 14.61,39.18 R30.1 R29.2
N$37
  Top 0.508: U4.5 1.78,26.36 1.78,24 R31.1
N$38
  Top 0.508: R32.1 1.52,33.78 CHARGE.C
N$42
  Top 0.254: POWER.A 3.05,39.24 1.4,37.59 R33.2
N$47
  Top 0.406: RM3.2.2 RM3.1.2
  Top 0.508: RM3.1.2 C87.2
N$53
  Top 0.254: 43.69,6.1 44.32,5.46 53.21,5.46 R2.1
  Top 1.016: LAN1.KG 42.63,6.1 43.69,6.1
N$57
  Top 0.254: 33.02,6.22 37.85,6.22 39.12,7.49 43.81,7.49 45.09,6.22 53.21,6.22 R4.1
  Top 1.016: LAN1.KY 31.92,6.22 33.02,6.22
PORSTN  (via drill 0.6)
  Top 0.254: EXT3.15 45.97,60.96 43.69,58.67 33.53,58.67 v33.02,59.18 | 3.68,61.21 4.19,61.72 4.19,66.04 v4.06,66.17
  Top 0.508: RESET.2_1 2.79,61.21 3.68,61.21
  Bottom 0.254: 48.26,62.23 56.52,62.23 | 17.53,70.1 17.78,69.85 17.78,68.07 20.45,65.41 25.78,65.41 26.42,64.77 32.26,64.77 33.02,64.01 v33.02,59.18 33.02,58.8 31.5,57.28 31.5,51.18 30.1,49.78 30.1,49.15 31.5,47.75 31.5,43.31 32.51,42.29 32.51,38.35 33.02,37.85 33.02,27.18 33.53,26.67 35.43,26.67 36.07,26.04 | 15.24,69.85 12.7,69.85 | 10.41,69.6 10.16,69.85 5.59,69.85 5.08,69.34 5.08,67.18 v4.06,66.17
  Bottom 0.813: RST_RT.1 10.41,69.6
  Bottom 1.016: EXT3.15 48.26,62.23 | 56.52,62.23 EXT4.19 | 12.7,69.85 RST_RT.1 | 17.53,70.1 RST.P$1 15.24,69.85 | EXT1.3 36.7,25.4 36.07,26.04
REL1_NC
  Top 3.048: CON1.3 24.72,88.98 REL1.O
  Bottom 3.048: CON1.3 24.72,88.98 REL1.O
REL1_NO
  Top 2.54: REL1.S 34.72,88.98
  Top 3.048: 34.72,88.98 CON1.1
  Bottom 2.54: REL1.S 34.72,88.98
  Bottom 3.048: 34.72,88.98 CON1.1
REL2_NC
  Top 2.54: REL2.O 40.72,88.98
  Top 3.048: 40.72,88.98 CON2.3
  Bottom 2.54: REL2.O 40.72,88.98
  Bottom 3.048: 40.72,88.98 CON2.3
REL2_NO
  Top 3.048: CON2.1 50.72,88.98 REL2.S
  Bottom 3.048: CON2.1 50.72,88.98 REL2.S
RIN
  Top 0.254: 19.68,66.17 20.95,64.9 22.1,64.9 22.86,64.14 22.86,62.23 23.37,61.72
  Top 0.508: R15.2 19.68,66.17
  Top 1.016: R15.2 RIN.P$1 | 23.37,61.72 EXT2.13
RTS_N
  Top 0.178: 46.3,52.25 47.68,52.25
  Top 0.203: 46.23,52.32 46.3,52.25 | 47.68,52.25 47.75,52.32
  Top 0.254: 22.48,60.07 23.37,59.18 27.05,59.18 31.11,55.12 43.43,55.12 46.23,52.32 | 47.75,52.32 54.61,59.18 54.61,64.01 57.15,66.55 57.15,66.93
  Top 1.016: 22.48,60.07 EXT2.15 | 57.15,66.93 57.53,67.31 EXT4.15
RXD
  Top 0.178: 45.9,49.35 48.08,49.35
  Top 0.203: 45.87,49.38 45.9,49.35 | 48.08,49.35 48.11,49.38
  Top 0.254: 9.65,63.5 10.92,62.23 14.73,62.23 15.24,61.72 15.24,60.2 15.75,59.69 16.89,59.69 17.4,59.18 20.07,59.18 21.59,57.66 26.29,57.66 30.35,53.59 41.66,53.59 45.87,49.38 | 59.05,63.5 57.28,63.5 56.13,62.36 56.13,57.4 48.11,49.38
  Top 1.016: EXT2.26 9.65,63.5 | 59.05,63.5 EXT4.18
RXIM0
  Top 0.178: 13.14,26.23 12.87,26.5 12.87,29.05 12.83,29.08
  Top 0.254: 13.21,24.64 13.08,24.51 13.08,23.75 13.46,23.37 19.18,23.37 21.08,21.46 21.08,19.18 21.34,18.92 21.59,18.92 21.97,19.3 21.97,19.43 | RM4.4.1 10.03,30.61 10.54,30.1 11.81,30.1 12.83,29.08
  Top 0.61: 13.21,24.64 EXT1.21 13.14,26.23
  Top 0.762: 21.97,19.43 21.97,20.05 LAN2.8
RXIM1
  Top 0.178: 18.36,26.09 17.96,26.49 17.96,28.57 | 45.35,39.2 47.93,39.2
  Top 0.203: 17.96,28.57 17.98,28.6 | 47.93,39.2 47.95,39.23
  Top 0.254: 17.98,28.6 29.76,40.37 44.18,40.37 45.35,39.2 | 59.05,45.72 54.45,45.72 47.95,39.23
  Top 0.762: EXT1.17 18.36,26.09
  Top 1.016: 59.05,45.72 EXT4.32
RXIM2
  Top 0.178: 23.44,26.09 23.04,26.49 23.04,28.65 | 45.91,34.12 47.93,34.12
  Top 0.203: 23.04,28.65 23.06,28.68 | 47.93,34.12 47.95,34.15
  Top 0.254: 23.06,28.68 31.91,37.53 42.51,37.53 45.91,34.12 | 47.95,34.15 54.45,40.64 59.05,40.64
  Top 0.762: EXT1.13 23.44,26.09
  Top 1.016: 59.05,40.64 EXT4.36
RXIM3
  Top 0.178: 28.51,26.1 28.11,26.5 28.11,28.74 28.14,28.78 | 46.1,29.05 47.93,29.05
  Top 0.203: 46.08,29.07 46.1,29.05 | 47.93,29.05 47.95,29.07
  Top 0.254: 28.14,28.78 34.1,34.73 40.41,34.73 46.08,29.07 | 59.05,35.56 54.45,35.56 47.95,29.07
  Top 0.762: EXT1.9 28.51,26.1
  Top 1.016: 59.05,35.56 EXT4.40
RXIM4
  Top 0.203: 33.6,26.09 33.2,26.49 33.2,30.18 33.25,30.23
  Top 0.254: 33.53,24.64 33.27,24.38 33.27,23.88 33.66,23.5 37.21,23.5 39.37,21.34 39.37,19.43 39.62,19.18 39.88,19.18 40.39,19.68 | 33.25,30.23 34.14,31.11 RM3.4.1
  Top 0.508: 33.53,24.64 EXT1.5 33.6,26.09
  Top 1.016: LAN1.8 40.39,19.68
RXIP0
  Top 0.178: 12.13,26.1 12.54,26.5 12.54,28.61 12.5,28.65
  Top 0.254: 12.13,24.7 12.57,24.26 12.57,23.5 13.21,22.86 18.92,22.86 20.57,21.21 20.57,18.92 20.83,18.67 20.83,18.41 | RM4.3.1 9.14,30.38 9.93,29.59 11.56,29.59 12.5,28.65
  Top 0.61: 12.13,24.7 EXT1.23 12.13,26.1
  Top 0.762: 20.83,18.41 20.83,17.63 LAN2.7
RXIP1
  Top 0.178: 17.2,26.09 17.6,26.49 17.6,28.82 | 45.58,39.57 45.62,39.53 47.66,39.53 47.7,39.57
  Top 0.203: 17.6,28.82 17.63,28.84
  Top 0.254: 17.63,28.84 29.59,40.8 44.35,40.8 45.58,39.57 | 47.7,39.57 54.28,46.15 56.06,46.15 56.9,46.99
  Top 0.762: EXT1.19 17.2,26.09
  Top 1.016: 56.9,46.99 EXT4.31
RXIP2
  Top 0.178: 22.28,26.09 22.68,26.49 22.68,28.89 | 46.14,34.49 46.18,34.45 47.66,34.45
  Top 0.203: 22.68,28.89 22.71,28.92 | 47.66,34.45 47.69,34.48
  Top 0.254: 22.71,28.92 31.75,37.96 42.67,37.96 46.14,34.49 | 47.69,34.48 54.28,41.07 56.06,41.07 56.9,41.91
  Top 0.762: EXT1.15 22.28,26.09
  Top 1.016: 56.9,41.91 EXT4.35
RXIP3
  Top 0.178: 27.37,26.1 27.76,26.49 27.76,28.99 27.8,29.03 | 46.37,29.38 47.66,29.38
  Top 0.203: 46.34,29.4 46.37,29.38 | 47.66,29.38 47.69,29.4
  Top 0.254: 56.9,36.83 56.06,35.99 54.28,35.99 47.69,29.4 | 46.34,29.4 40.6,35.14 33.91,35.14 27.8,29.03
  Top 0.762: EXT1.11 27.37,26.1
  Top 1.016: 56.9,36.83 EXT4.39
RXIP4
  Top 0.203: 32.44,26.09 32.84,26.49 32.84,30.56
  Top 0.254: 32.51,24.64 32.77,24.38 32.77,23.62 33.4,22.99 36.96,22.99 38.86,21.08 38.86,19.18 39.12,18.92 39.12,18.16 | RM3.3.1 34.29,32 32.84,30.56
  Top 0.508: 32.51,24.64 EXT1.7 32.44,26.09
  Top 1.016: LAN1.7 39.12,17.63 39.12,18.16
SPI_CLK  (via drill 0.6)
  Top 0.254: v26.29,48.26 26.42,48.39 27.56,48.39 28.32,47.62 28.96,47.62 29.72,46.86 36.7,46.86 37.97,45.59 40.39,45.59 v40.51,45.47 | 8.89,70.1 8.13,69.34 8.13,67.56 6.1,65.53 6.1,60.71 v6.6,60.2
  Top 0.508: v21.34,51.44 R17.2
  Top 1.016: 8.89,70.1 PROG.4
  Bottom 0.178: 46.01,34.51 46.05,34.47 48.21,34.47 48.25,34.43
  Bottom 0.254: 46.2,40.64 45.85,40.64 43.81,42.67 43.81,43.56 41.91,45.47 v40.51,45.47 40.39,45.59 38.99,45.59 38.61,45.21 38.61,41.91 46.01,34.51 | v26.29,48.26 26.42,48.39 26.42,49.78 24.64,51.56 21.46,51.56 v21.34,51.44 15.62,57.15 8.13,57.15 6.6,58.67 v6.6,60.2 | 48.25,34.43 48.9,33.78 48.9,32.77 52.07,29.59 52.07,28.45 53.21,27.3 53.21,23.24 54.99,21.46 54.99,20.19 55.63,19.56 55.63,17.53
  Bottom 0.508: 55.63,17.53 SPI_CLK/EJTAG_TCK.3
  Bottom 1.016: 46.2,40.64 EXT3.7
SPI_CS0  (via drill 0.6)
  Top 0.254: v27.81,50.55 39.12,50.55 43.05,46.61 43.05,45.34 44.07,44.32 45.72,44.32 46.1,43.94 | v7.11,61.34 7.11,65.79 8.64,67.31 8.64,68.33 10.79,70.48
  Top 0.508: 46.1,43.94 46.86,43.18 EXT3.8
  Top 1.016: 10.79,70.48 PROG.5
  Bottom 0.254: v27.81,50.55 27.18,50.55 25.15,52.58 22.73,52.58 21.84,53.47 20.83,53.47 16.13,58.17 9.91,58.17 7.11,60.96 v7.11,61.34
SPI_CS1  (via drill 0.6)
  Top 0.254: v9.02,22.48 8.89,22.61 8.89,24.51
  Top 0.61: R8.1 R11.2 R7.2 v21.59,41.66
  Top 1.016: 8.89,24.51 EXT1.25
  Bottom 0.254: v21.59,41.66 20.45,40.51 20.45,34.8 17.14,31.5 17.14,30.35 16.64,29.84 11.18,29.84 10.16,28.83 10.16,26.67 9.65,26.16 | v9.02,22.48 9.4,22.86 24.89,22.86 26.42,21.34 27.43,21.34 27.94,21.84 41.78,21.84 44.45,19.18 44.45,18.41 45.34,17.53 47.12,17.53 47.75,18.16 47.75,19.3 48.39,19.94 49.53,19.94 50.16,19.3 50.16,18.16 52.2,16.13 52.2,15.62 52.7,15.11 53.72,15.11 54.86,13.97
  Bottom 0.508: 54.86,13.97 EJTAG_TMS/SPI_CS1.3
  Bottom 1.016: EXT1.25 9.65,26.16
SPI_MISO  (via drill 0.6)
  Top 0.254: v27.18,47.5 27.18,46.61 27.94,45.85 35.94,45.85 37.34,44.45 38.48,44.45 39.24,43.69 v39.5,43.69 | 3.05,70.36 2.54,69.85 2.54,67.44 1.91,66.8 1.91,58.67 2.41,58.17 v8.64,58.17 | v21.34,52.58 21.84,52.07 RM1.2.2
  Top 0.508: R18.2 20.45,52.7 21.21,52.7 v21.34,52.58
  Top 0.762: 3.05,70.36 PROG.2
  Bottom 0.254: v39.5,43.69 39.75,43.69 40.13,44.07 41.02,44.07 41.4,43.69 41.4,42.04 44.83,38.61 44.83,36.96 46.23,35.56 | v27.18,47.5 27.18,48.64 26.92,48.9 26.92,50.04 24.89,52.07 21.84,52.07 v21.34,52.58 20.95,52.58 15.88,57.66 9.14,57.66 v8.64,58.17
  Bottom 0.508: EXT3.5 48.39,35.56 49.91,34.04 EJTAG_TDI/SPI_MISO.3
  Bottom 1.016: 46.23,35.56 EXT3.5
SPI_MOSI  (via drill 0.6)
  Top 0.254: v28.57,46.74 28.96,46.35 36.32,46.35 37.72,44.96 39.37,44.96 v39.5,44.83 | v5.21,59.05 5.08,59.18 5.08,69.85 | v53.98,31.62 v57.78,31.62
  Top 0.508: v21.84,46.74 21.84,45.72
  Top 0.61: 21.84,45.72 R9.1
  Top 0.762: 5.08,69.85 PROG.3
  Top 1.016: 21.84,45.72 R12.2
  Bottom 0.254: 46.35,38.73 46.23,38.86 46.23,38.91 43.18,41.96 43.18,43.43 42.04,44.58 39.75,44.58 v39.5,44.83 | v5.21,59.05 7.62,56.64 9.65,56.64 10.92,55.37 10.92,49.28 13.46,46.74 v21.84,46.74 21.97,46.61 28.45,46.61 v28.57,46.74 | 47.88,38.1 50.42,35.56 52.96,35.56 53.59,34.92 53.59,32.26 53.98,31.88 v53.98,31.62
  Bottom 0.508: v57.78,31.62 EJTAG_TDO/SPI_MOSI.3
  Bottom 1.016: 46.35,38.73 EXT3.6 47.88,38.1
TXD
  Top 0.178: 46.3,49.71 47.68,49.71
  Top 0.203: 46.28,49.73 46.3,49.71 | 47.68,49.71 47.7,49.73
  Top 0.254: EXT2.24 11.46,63.5 | 46.28,49.73 41.91,54.1 30.61,54.1 26.54,58.17 21.84,58.17 20.32,59.69 18.41,59.69 17.78,60.33 17.78,64.26 17.27,64.77 13.46,64.77 12.19,63.5 | 47.7,49.73 55.63,57.66 55.63,62.48 57.15,64.01 57.15,64.39
  Top 1.016: 11.46,63.5 12.19,63.5 | 57.15,64.39 57.53,64.77 EXT4.17
TXOM0
  Top 0.178: 10.32,23.96 10.32,26.84 10.73,27.24
  Top 0.203: 10.35,23.94 10.32,23.96
  Top 0.254: 14.35,19.43 13.97,19.05 13.46,19.05 13.21,19.3 13.21,21.08 10.35,23.94 | RM4.2.1 8.38,30.38 9.93,28.83 10.54,28.83
  Top 0.508: EXT1.24 10.54,28.83
  Top 0.762: 10.73,27.24 EXT1.24 | LAN2.2 14.35,20.05 14.35,19.43
TXOM1
  Top 0.178: 45.15,41.72 45.17,41.74 47.93,41.74
  Top 0.203: 47.93,41.74 47.95,41.77
  Top 0.254: 16.26,28.82 16.26,29.07 28.91,41.72 45.15,41.72 | 59.05,48.26 54.45,48.26 47.95,41.77
  Top 0.61: EXT1.20 16.26,28.19 16.26,28.82
  Top 1.016: 59.05,48.26 EXT4.30
TXOM2
  Top 0.178: 45.73,36.66 47.93,36.66
  Top 0.203: 47.93,36.66 47.95,36.69
  Top 0.254: 21.34,28.93 21.34,29.2 31.06,38.92 43.47,38.92 45.73,36.66 | 47.95,36.69 54.45,43.18 59.05,43.18
  Top 0.61: EXT1.16 21.34,28.19 21.34,28.93
  Top 1.016: 59.05,43.18 EXT4.34
TXOM3
  Top 0.178: 45.74,31.59 47.93,31.59
  Top 0.203: 47.93,31.59 47.95,31.61
  Top 0.254: 26.67,28.57 26.54,28.7 26.54,29.35 33.33,36.13 41.19,36.13 45.74,31.59 | 59.05,38.1 54.45,38.1 47.95,31.61
  Top 1.016: EXT1.12 26.67,28.57 | 59.05,38.1 EXT4.38
TXOM4
  Top 0.178: 30.73,24.51 30.66,24.59 30.66,26.85 31.06,27.25
  Top 0.254: 32.26,19.56 32,19.3 31.37,19.3 30.73,19.94 30.73,24.51 | 30.86,28.83 30.73,28.96 30.73,29.72 33.78,32.77 RM3.2.1
  Top 0.508: 31.06,27.25 EXT1.8 30.86,28.83
  Top 1.016: LAN1.2 32.76,20.06 32.26,19.56
TXOP0
  Top 0.178: 9.99,23.62 9.99,26.84 9.59,27.24
  Top 0.203: 10.02,23.6 9.99,23.62
  Top 0.254: 13.21,18.29 13.21,18.54 12.7,19.05 12.7,20.92 10.02,23.6 | RM4.1.1 7.49,30.5 8.89,29.11 8.89,28.96
  Top 0.508: EXT1.26 8.89,28.96
  Top 0.762: 9.59,27.24 EXT1.26 | LAN2.1 13.21,17.63 13.21,18.29
TXOP1
  Top 0.178: 45.31,42.15 45.39,42.08 47.66,42.08
  Top 0.203: 47.66,42.08 47.69,42.1
  Top 0.254: 45.31,42.15 28.74,42.15 14.91,28.32 | 47.69,42.1 54.28,48.69 56.06,48.69 56.9,49.53
  Top 0.762: EXT1.22 14.53,27.94 14.91,28.32
  Top 1.016: 56.9,49.53 EXT4.29
TXOP2
  Top 0.178: 45.96,37.03 46,36.99 47.66,36.99
  Top 0.203: 47.66,36.99 47.69,37.02
  Top 0.254: 45.96,37.03 43.64,39.36 30.9,39.36 20.12,28.57 | 47.69,37.02 54.28,43.61 56.06,43.61 56.9,44.45
  Top 0.61: EXT1.18 19.48,27.94 20.12,28.57
  Top 1.016: 56.9,44.45 EXT4.33
TXOP3
  Top 0.178: 45.96,31.95 46,31.91 47.66,31.91 47.7,31.95
  Top 0.254: 56.9,39.37 56.06,38.53 54.28,38.53 47.7,31.95 | 45.96,31.95 41.35,36.56 33.16,36.56 25.04,28.45
  Top 0.762: EXT1.14 24.54,27.94 25.04,28.45
  Top 1.016: 56.9,39.37 EXT4.37
TXOP4
  Top 0.178: 30.23,24.51 30.3,24.59 30.3,26.85 29.9,27.25
  Top 0.254: 31.5,18.41 30.23,19.68 30.23,24.51 | 30.1,28.83 30.23,28.96 30.23,29.84 34.04,33.66 RM3.1.1
  Top 0.508: 29.9,27.25 EXT1.10 30.1,28.83
  Top 1.016: LAN1.1 31.5,17.63 31.5,18.41
UART_RXD2  (via drill 0.6)
  Top 0.254: v44.96,45.21 44.07,45.21 43.56,45.72 43.56,46.86 39.37,51.05 29.08,51.05 25.02,55.12 19.05,55.12 16,58.17 10.29,58.17 8.89,59.56 8.38,59.05 6.48,59.05 5.59,59.94 5.59,65.79 7.62,67.82 7.62,71.75 6.99,72.39 5.59,72.39 4.57,73.41
  Top 0.508: 4.57,73.41 R64.1
  Top 1.016: 8.89,59.56 EXT2.25 | R64.1 6.36,74.55 D2.A
  Bottom 0.178: 46.27,44.67 46.3,44.63 48.08,44.63 48.11,44.6
  Bottom 0.254: 59.82,24.64 59.05,25.4 56.52,25.4 56.26,25.65 56.26,27.94 56.77,28.45 56.77,35.94 48.11,44.6 | v44.96,45.21 45.72,45.21 46.27,44.67
  Bottom 1.27: 59.82,24.64 UEXT.4
UART_TXD2  (via drill 0.6)
  Top 0.254: v44.45,46.23 44.45,46.74 39.62,51.56 29.34,51.56 25.27,55.63 19.3,55.63 16.26,58.67 13.72,58.67 12.06,60.33 | v9.65,68.2 9.65,67.56 7.62,65.53 7.62,62.87 8.26,62.23 9.4,62.23 10.67,60.96
  Top 0.762: 10.67,60.96 EXT2.23
  Top 0.813: EXT2.23 12.06,60.33
  Bottom 0.178: 45.52,44.27 47.68,44.27 47.71,44.23
  Bottom 0.203: 45.49,44.3 45.52,44.27
  Bottom 0.254: 56.9,24.13 55.75,25.27 55.75,28.19 56.26,28.7 56.26,35.69 47.71,44.23 | v44.45,46.23 44.07,45.85 44.07,44.83 44.6,44.3 45.49,44.3
  Bottom 0.61: v9.65,68.2 9.27,68.58 UART0.3
  Bottom 1.27: 56.9,24.13 UEXT.3
UGATE
  Bottom 0.254: 47.88,58.42 48.77,58.42 51.31,60.96 59.05,60.96
  Bottom 1.016: 59.05,60.96 EXT4.20 | EXT3.14 47.88,58.42
UPHY0_PADM  (via drill 0.6)
  Top 0.254: v46.23,23.11 46.35,22.99 46.35,22.61 C2.1 46.35,21.59 46.1,21.34 45.21,21.34 43.94,20.07 43.94,17.53 45.21,16.26 47.5,16.26 48.01,15.75 48.01,15.11 48.26,14.86
  Top 1.016: USB_HOST.2 48.5,14.62 48.26,14.86
  Bottom 0.254: 36.32,28.45 36.07,28.45 35.56,28.96 35.56,29.46 36.07,29.97 39.24,29.97 46.1,23.11 v46.23,23.11
  Bottom 0.813: 36.32,28.45 EXT1.4
UPHY0_PADP  (via drill 0.6)
  Top 0.254: v47.37,23.11 C1.1 47.37,21.97 46.23,20.83 45.47,20.83 44.45,19.81 44.45,17.78 45.47,16.76 48.26,16.76
  Top 1.016: USB_HOST.3 48.77,16.76 48.26,16.76
  Bottom 0.254: v47.37,23.11 46.48,24 45.97,24 39.5,30.48 35.81,30.48 35.05,29.72 35.05,28.57 34.92,28.45
  Bottom 0.813: 34.92,28.45 34.42,27.94 EXT1.6
VBAT  (via drill 0.6)
  Top 0.508: 4.7,28.64 4.7,28.25 U4.3
  Top 0.762: BAT.1 6.46,19.94 C8.1
  Top 1.016: 4.7,28.64 v4.7,29.08 v4.7,29.97 | FET1.3 6.77,36.45 v5.71,36.45 v5.71,37.34
  Bottom 1.016: v4.7,29.08 4.7,23.24 6.35,21.59 BAT.1 | v4.7,29.08 v4.7,29.97 | v4.7,29.97 4.7,32.26 5.71,33.27 v5.71,36.45 v5.71,37.34 | v4.7,29.08 v4.7,29.97
VCC  (via drill 0.6)
  Top 0.254: 61.47,9.4 61.09,9.02 57.78,9.02 57.4,9.4
  Top 0.381: 58.42,82.55 EXT4.3
  Top 0.406: v61.47,81.28 61.59,81.41 | R64.2 1.4,75.95 1.4,90.93
  Top 0.508: v61.47,81.28 59.69,81.28 58.42,82.55 | 1.4,90.93 R3.2 | RM1.4.1 RM1.3.1 RM1.2.1 RM1.1.1 24.26,48.77 L1.1 | EXT4.3 59.05,83.82 61.21,83.82 61.72,83.31 61.72,81.53 61.59,81.41 | 22.48,5.21 23.11,4.57 39.5,4.57 40.01,5.08 40.51,4.57 v52.32,4.57 | R84.2 R82.2 57.4,9.4 | R83.2 61.47,9.4
  Top 0.762: R64.2 1.27,73.03 PROG.1
  Top 1.016: EXT3.2 48.64,27.94 49.02,28.32 54.48,28.32 56.13,26.67 UEXT.1 57.78,27.18 60.33,29.72 62.48,29.72 | 62.48,29.72 62.48,15.11 61.34,13.97 v61.34,11.05 61.98,10.41 R83.2 | 62.48,29.72 62.48,80.26 v61.47,81.28 | v42.29,60.58 39.75,60.58 EXT2.1 | 25.4,44.96 R8.2 | 25.4,44.96 R9.2 25.4,46.48 24.89,46.99 24.89,48.13 L1.1 | v34.67,44.96 25.4,44.96 | LAN2.AG 21.72,5.96 22.48,5.21 | LAN1.AG 40.01,5.08
  Bottom 0.508: v61.47,81.28 59.05,81.28 EXT4.3
  Bottom 0.762: v61.34,11.05 60.45,10.16 56.64,10.16 52.32,5.84 v52.32,4.57
  Bottom 1.016: EXT3.2 46.48,27.94 34.67,39.75 v34.67,44.96 34.67,51.44 42.29,59.05 v42.29,60.58 | PROG.1 3.43,73.28 7.37,73.28 8.64,74.55 12.83,74.55 14.35,76.07 17.53,76.07 25.53,68.07 27.3,68.07 27.94,67.44 37.85,67.44 41.02,64.26 41.02,62.87 39.37,61.21 EXT2.1
VEE  (via drill 0.6)
  Top 0.406: EXT4.6 59.82,80.01
  Top 0.508: EXT4.6 59.05,78.74 v56.52,78.74 56.39,78.87 56.39,80.77 56.9,81.28 58.55,81.28 59.82,80.01
  Bottom 0.508: EXT4.6 59.05,78.74 v56.52,78.74
  Bottom 1.016: EXT3.4 45.47,33.02 37.21,41.27 37.21,50.42 44.83,58.04 44.83,63.88 46.1,65.15 48.26,65.15 55.12,72.01 55.12,75.56 55.88,76.33 55.88,78.11 v56.52,78.74
VPP  (via drill 0.6)
  Top 0.508: 33.4,17.02 32.64,16.26 27.3,16.26 26.8,16.76 26.29,16.26 17.14,16.26 16.38,17.02
  Top 0.762: 26.8,16.76 v26.8,22.1
  Top 1.016: LAN1.3 34.01,17.62 33.4,17.02 | LAN2.3 15.78,17.62 16.38,17.02 | 26.8,23.11 C13.2 | 26.8,23.11 C89.2 | v26.8,22.1 26.8,23.11
  Bottom 0.762: 50.04,20.83 43.94,20.83 42.16,22.61 27.3,22.61 v26.8,22.1
  Bottom 1.016: 50.04,20.83 50.67,21.46 50.67,22.99 48.64,25.02 48.64,28.83 EXT3.3 45.97,30.48 35.94,40.51 35.94,50.93 43.56,58.55 43.56,64.52 45.47,66.42 47.62,66.42 53.85,72.64 53.85,76.2 54.61,76.96 54.61,78.74 55.88,80.01 EXT4.5
WLAN_LED
  Bottom 0.254: 20.32,62.23 20.32,64.77 18.03,67.06 17.14,67.06 16.51,67.69
  Bottom 1.016: EXT2.17 20.32,62.23 | 16.51,67.69 WLAN_LED.P$1